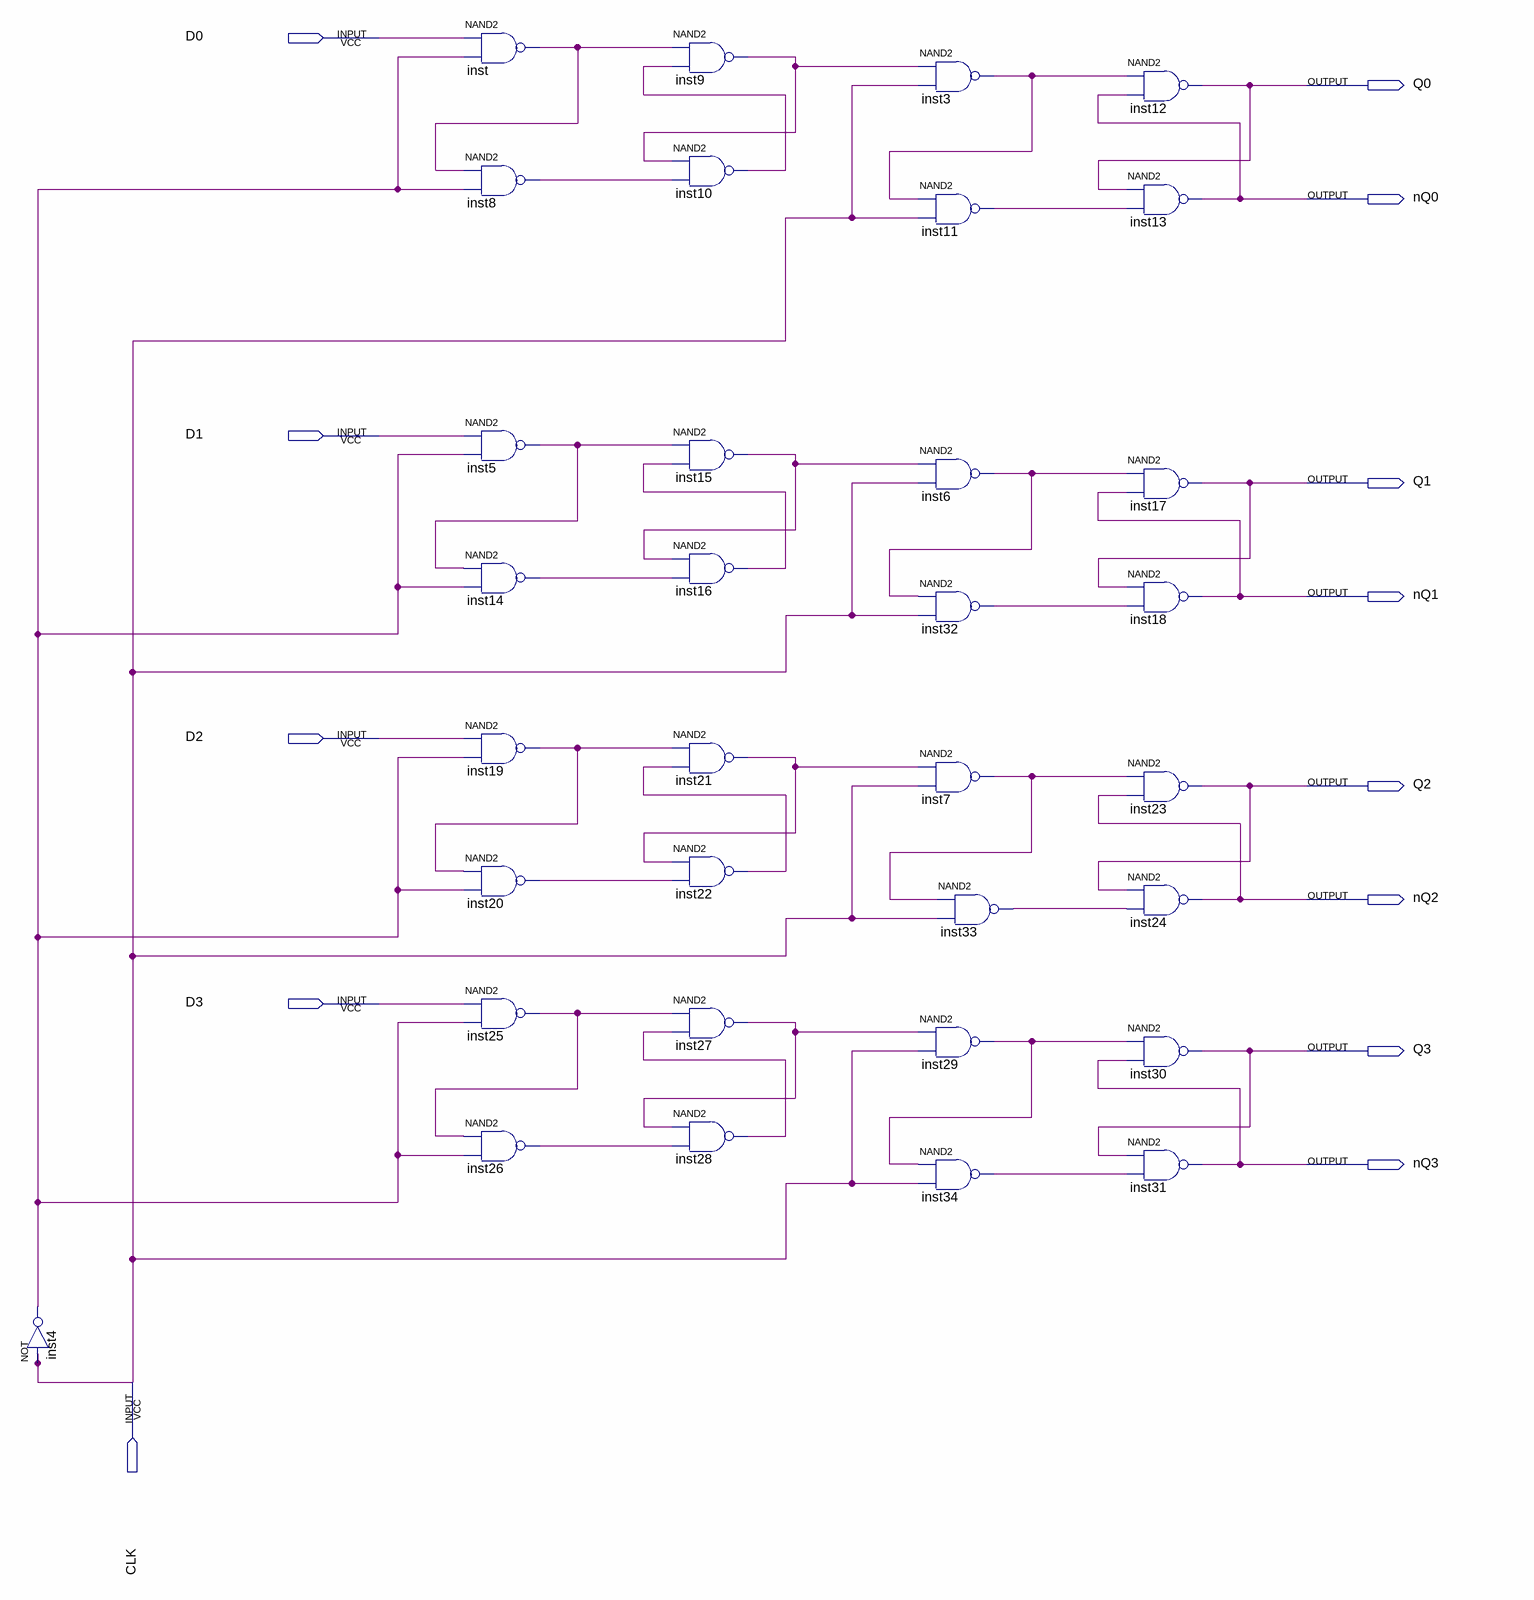
[diagram p0: schematic sheet]
// Quartus schematic Reg.bdf as structural Verilog: 33 symbols, 13 pins
module Reg (
  input  D0,
  input  D1,
  input  D2,
  input  D3,
  input  CLK,
  output Q0,
  output nQ0,
  output Q1,
  output nQ1,
  output Q2,
  output nQ2,
  output Q3,
  output nQ3
);

  wire inst3_out, inst4_out, inst5_out, inst6_out, inst7_out, inst8_out, inst9_out, inst10_out, inst11_out,
       inst14_out, inst15_out, inst16_out, inst19_out, inst20_out, inst21_out, inst22_out, inst25_out,
       inst26_out, inst27_out, inst28_out, inst29_out, inst32_out, inst33_out, inst34_out, inst_out;

  not inst4 (inst4_out, CLK);
  nand inst (inst_out, D0, inst4_out);
  nand inst8 (inst8_out, inst_out, inst4_out);
  nand inst5 (inst5_out, D1, inst4_out);
  nand inst14 (inst14_out, inst5_out, inst4_out);
  nand inst19 (inst19_out, D2, inst4_out);
  nand inst20 (inst20_out, inst19_out, inst4_out);
  nand inst25 (inst25_out, D3, inst4_out);
  nand inst26 (inst26_out, inst25_out, inst4_out);
  nand inst9 (inst9_out, inst_out, inst10_out);
  nand inst10 (inst10_out, inst9_out, inst8_out);
  nand inst15 (inst15_out, inst5_out, inst16_out);
  nand inst16 (inst16_out, inst15_out, inst14_out);
  nand inst21 (inst21_out, inst19_out, inst22_out);
  nand inst22 (inst22_out, inst21_out, inst20_out);
  nand inst27 (inst27_out, inst25_out, inst28_out);
  nand inst28 (inst28_out, inst27_out, inst26_out);
  nand inst3 (inst3_out, inst9_out, CLK);
  nand inst11 (inst11_out, inst3_out, CLK);
  nand inst6 (inst6_out, inst15_out, CLK);
  nand inst32 (inst32_out, inst6_out, CLK);
  nand inst7 (inst7_out, inst21_out, CLK);
  nand inst33 (inst33_out, inst7_out, CLK);
  nand inst29 (inst29_out, inst27_out, CLK);
  nand inst34 (inst34_out, inst29_out, CLK);
  nand inst12 (Q0, inst3_out, nQ0);
  nand inst13 (nQ0, Q0, inst11_out);
  nand inst17 (Q1, inst6_out, nQ1);
  nand inst18 (nQ1, Q1, inst32_out);
  nand inst23 (Q2, inst7_out, nQ2);
  nand inst24 (nQ2, Q2, inst33_out);
  nand inst30 (Q3, inst29_out, nQ3);
  nand inst31 (nQ3, Q3, inst34_out);
endmodule
